# EAGLE schematic LED_Board (EAGLE 8.5.2)
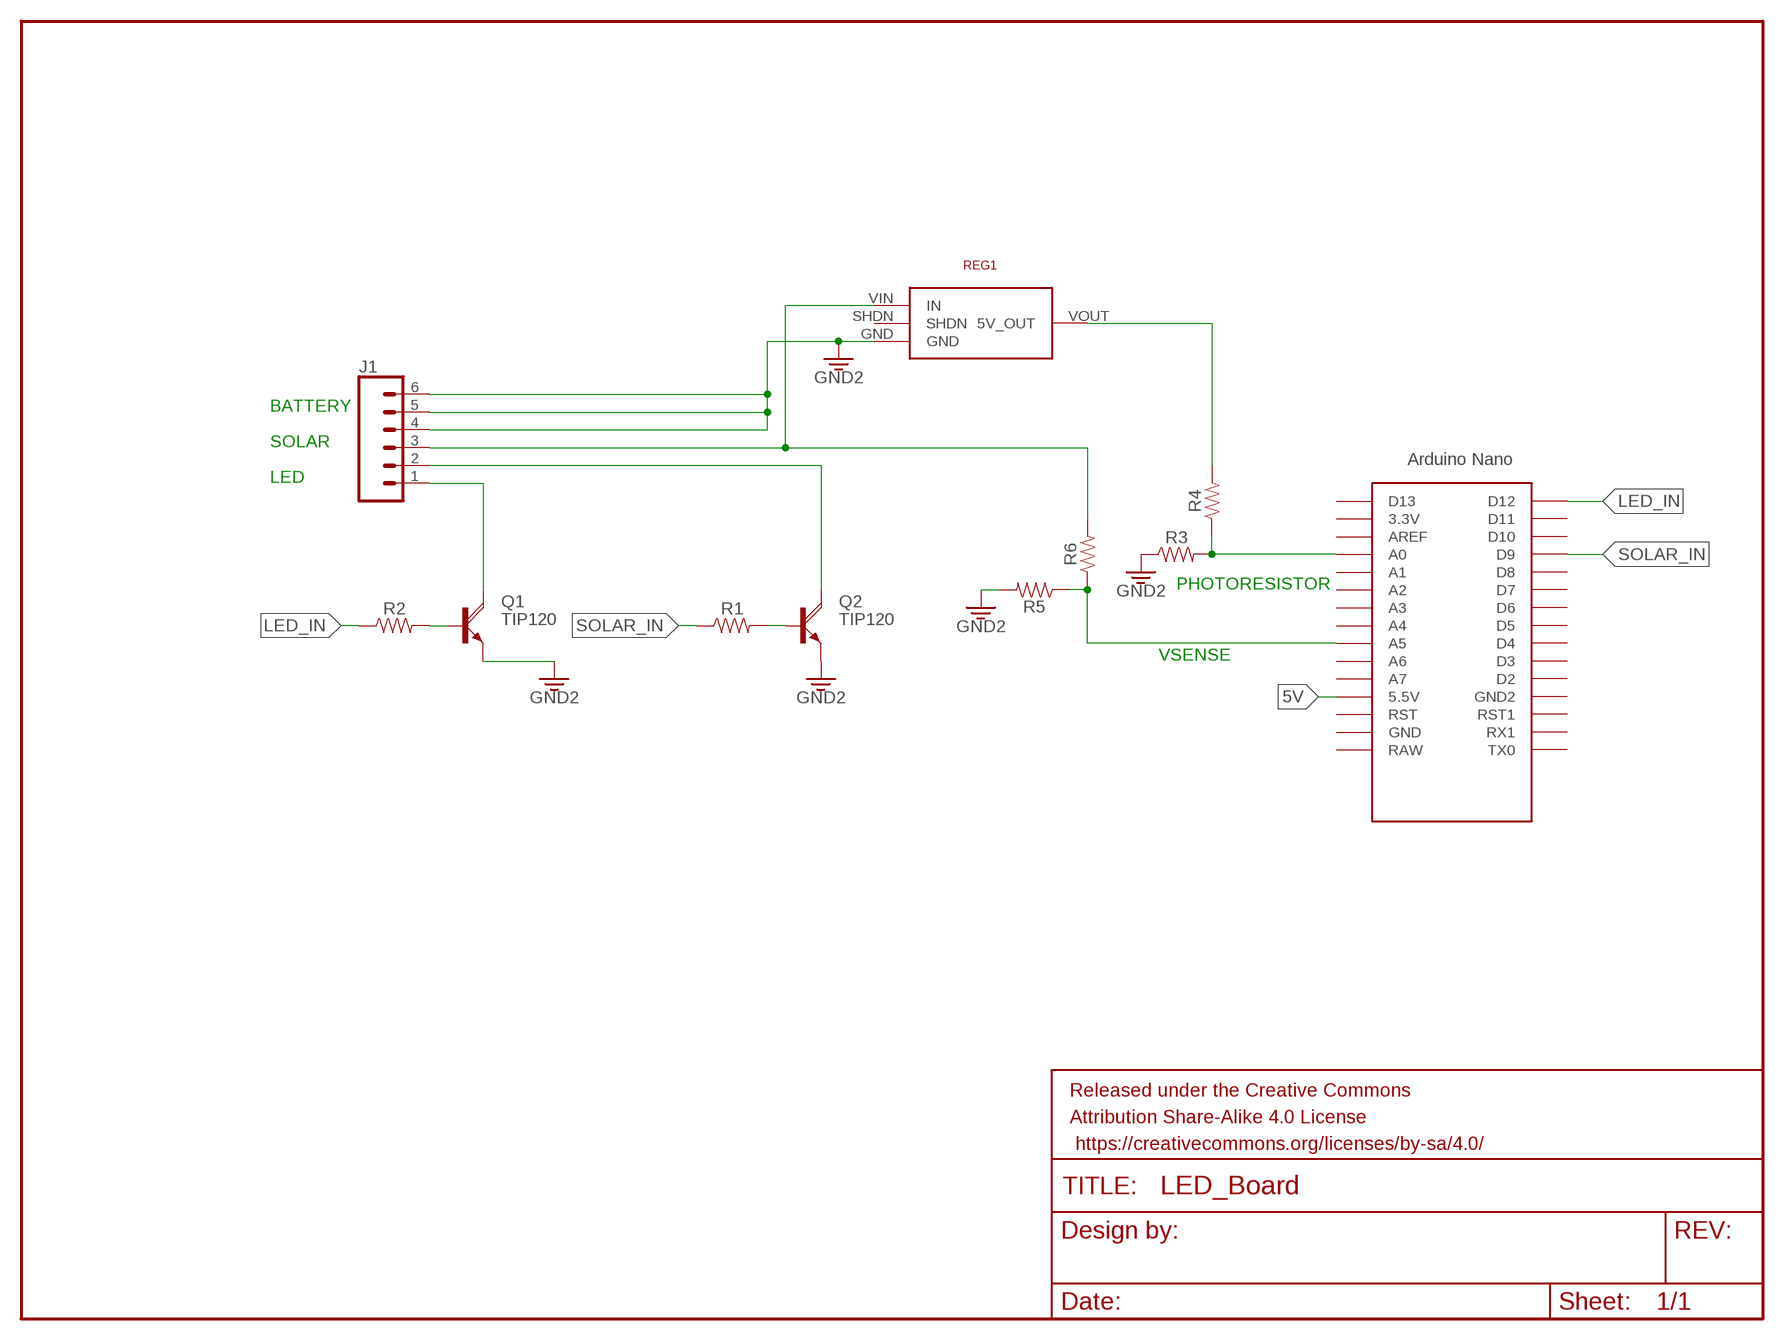
[diagram p0: schematic, sheet 1]

## Parts
FRAME1  FRAME-LETTER  [CREATIVE_COMMONS]
J1  CONN_063.5MM-6  [SCREWTERMINAL-3.5MM-6]
Q1  TIP120  [TO220AH]
Q2  TIP120  [TO220AH]
R1  RESISTORAXIAL-0.3  [AXIAL-0.3]
R2  RESISTORAXIAL-0.3  [AXIAL-0.3]
R3  RESISTORAXIAL-0.3  [AXIAL-0.3]
R4  RESISTORAXIAL-0.3  [AXIAL-0.3]
R5  RESISTORAXIAL-0.3  [AXIAL-0.3]
R6  RESISTORAXIAL-0.3  [AXIAL-0.3]
REG1  POLOLU_D24V3F5  [POLOLU_D24V3F5]
U$1  NANO  [NANO]

## Nets
3.3V: J1.4 J1.5 J1.6 Q1.E Q2.E R3.P$1 R5.P$2 REG1.GND ; supply symbol labelled GND2
5V: R4.P$2 REG1.VOUT(5V_OUT) U$1.5V(5.5V)
LED_IN: R2.P$1 U$1.D12
N$1: J1.1 Q1.C
N$3: J1.2 Q2.C
N$4: R5.P$1 R6.P$1 U$1.A5
N$6: Q2.B R1.P$2
N$7: Q1.B R2.P$2
PHOTORESISTOR: R3.P$2 R4.P$1 U$1.A0
SOLAR_IN: R1.P$1 U$1.D9
VSENSE: J1.3 R6.P$2 REG1.VIN(IN)
Unconnected: REG1.SHDN U$1.3.3V U$1.A1 U$1.A2 U$1.A3 U$1.A4 U$1.A6 U$1.A7 U$1.AREF U$1.D2 U$1.D3 U$1.D4 U$1.D5 U$1.D6 U$1.D7 U$1.D8 U$1.D10 U$1.D11 U$1.D13 U$1.GND U$1.GND1(GND2) U$1.ICSP1 U$1.ICSP2 U$1.ICSP3 U$1.ICSP4 U$1.ICSP5 U$1.ICSP6 U$1.RAW U$1.RST U$1.RST1 U$1.RX1 U$1.TX0

## Notes on the sheet
- BATTERY
- SOLAR
- LED
- PHOTORESISTOR
- VSENSE

## Library data of the parts
FRAME1 = SparkFun-Aesthetics:FRAME-LETTER: Schematic Frame - Letter Standard 8.5x11 US Letter frame
J1 = SparkFun-Connectors:CONN_06: Multi connection point. Often used as Generic Header-pin footprint for 0.1 inch spaced/style header connections On any of the 0.1 inch spaced packages, you can populate with these: Break Away Headers - Straight <https://www.sparkfun.com/products/116> (PRT-00116) Break Away Male Headers - Right Angle <https://www.sparkfun.com/products/553> (PRT-00553) Female Headers <https://www.sparkfun.com/products/115> (PRT-00115) Break Away Headers - Machine Pin <https://www.sparkfun.com/products/117> (PRT-00117) Break Away Female Headers - Swiss Machine Pin <https://www.sparkfun.com/products/743> (PRT-00743) Arduino Stackable Header - 6 Pin <https://www.sparkfun.com/products/9280> (PRT-09280) For SCREWTERMINALS and SPRING TERMINALS visit here: Screw Terimnals on SparkFun.com <https://www.sparkfun.com/search/results?term=Screw+Terminals> (5mm/3.5mm/2.54mm spacing) This device is also useful as a general connection point to wire up your design to another part of your project. Our various solder wires solder well into these plated through hole pads. Hook-Up Wire - Assortment (Stranded, 22 AWG) <https://www.sparkfun.com/products/11375> (PRT-11375) Hook-Up Wire - Assortment (Solid Core, 22 AWG) <https://www.sparkfun.com/products/11367> (PRT-11367) View the entire wire category on our website here <https://www.sparkfun.com/categories/141>
Q1 Q2 = transistor-power:TIP120: NPN DARLINGTON TRANSISTOR
R1-R6 = SparkFun-Resistors:RESISTOR: Generic Resistor Package
REG1 = JOHN_LIBRARY:POLOLU_D24V3F5: Pololu 5v regulator 300mA
U$1 = Arduino-clone:NANO: Arduino Nano